# Altium schematic sheet P02_Power Management.SchDoc
size 386 x 246 mm
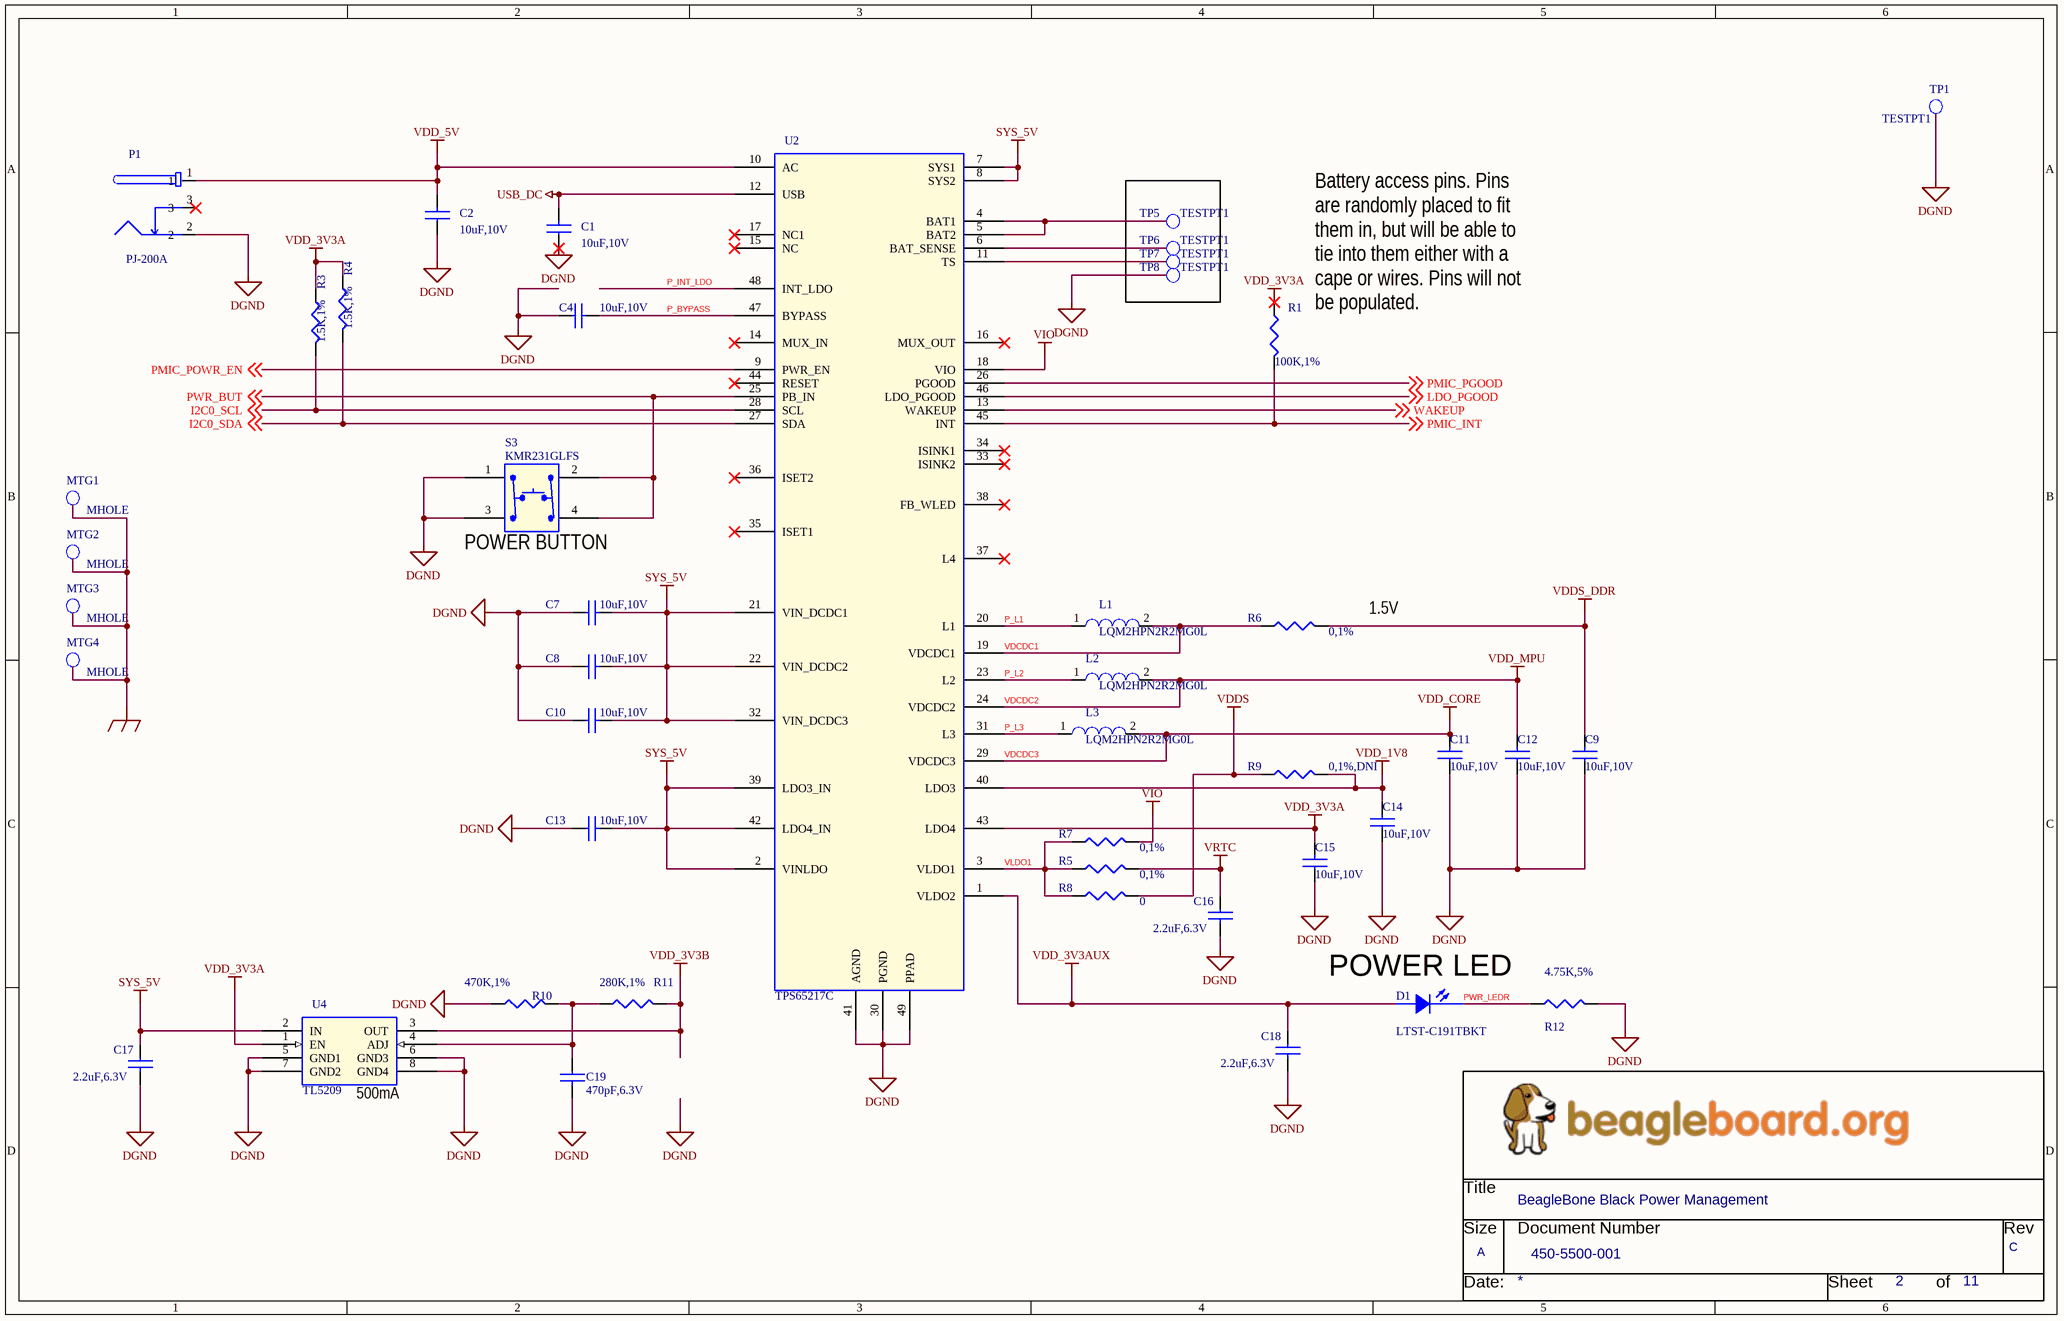
[diagram p0: P02_Power Management.SchDoc]

## Parts
*  Page Count: 11  Page Number: 2  Page Size: A  Title: BeagleBone Black Power Management  RevCode: C  Doc: 450-5500-001  (hidden comment: BeagleBoard_org)  (graphical)
C1  10uF,10V  [r402-25rd]
C2  10uF,10V  [r402-25rd]
C4  10uF,10V  [r402-25rd]
C7  10uF,10V  [r402-25rd]
C8  10uF,10V  [r402-25rd]
C9  10uF,10V  [r402-25rd]
C10  10uF,10V  [r402-25rd]
C11  10uF,10V  [r402-25rd]
C12  10uF,10V  [r402-25rd]
C13  10uF,10V  [r402-25rd]
C14  10uF,10V  [r402-25rd]
C15  10uF,10V  [r402-25rd]
C16  2.2uF,6.3V  [402]
C17  2.2uF,6.3V  [402]
C18  2.2uF,6.3V  [402]
C19  470pF,6.3V  [402]
D1  LTST-C191TBKT  [led1206-59x59]
L1  LQM2HPN2R2MG0L  [VLCF5020T]
L2  LQM2HPN2R2MG0L  [VLCF5020T]
L3  LQM2HPN2R2MG0L  [VLCF5020T]
MTG1  MHOLE  [mh230-156]
MTG2  MHOLE  [mh230-156]
MTG3  MHOLE  [mh230-156]
MTG4  MHOLE  [mh230-156]
P1  PJ-200A  [CONN3-PWR-PJ102A]
R1  100K,1%  [402]
R3  1.5K,1%  [402]
R4  1.5K,1%  [402]
R5  0,1%  [402]
R6  0,1%  [402]
R7  0,1%  [402]
R8  0  [402]
R9  0,1%,DNI  [402]
R10  470K,1%  [402]
R11  280K,1%  [402]
R12  4.75K,5%  [402]
S3  KMR231GLFS  [SM-SW-SPST-4-4]
TP1  TESTPT1  [tp1-8040]
TP5  TESTPT1  [tp1-8040]
TP6  TESTPT1  [tp1-8040]
TP7  TESTPT1  [tp1-8040]
TP8  TESTPT1  [tp1-8040]
U2  TPS65217C  [TBD]
U4  TL5209  [SO8-25X75]

## Nets
DGND: C1.1 C2.1 C4.1 C7.1 C8.1 C9.1 C10.1 C11.1 C12.1 C13.1 C14.1 C15.1 C16.2 C17.2 C18.2 C19.2 P1.2 R10.2 R12.1 S3.1(A1) S3.3(A2) TP1.1(TP) TP8.1(TP) U2.30(PGND) U2.41(AGND) U2.49(PPAD) U4.5(GND1) U4.6(GND3) U4.7(GND2) U4.8(GND4)
GND_EARTH: MTG1.1(TP) MTG2.1(TP) MTG3.1(TP) MTG4.1(TP)
SYS_5V: C7.2 C8.2 C10.2 C13.2 C17.1 U2.2(VINLDO) U2.7(SYS1) U2.8(SYS2) U2.21(VIN_DCDC1) U2.22(VIN_DCDC2) U2.32(VIN_DCDC3) U2.39(LDO3_IN) U2.42(LDO4_IN) U4.2(IN)
USB_DC: C1.2 U2.12(USB)
VDCDC2: C12.2 L2.2 U2.24(VDCDC2)  [also labelled VDD_MPU]
VDCDC3: C11.2 L3.2 U2.29(VDCDC3)  [also labelled VDD_CORE]
VDD_1V8: C14.2 R9.2 U2.40(LDO3)
VDD_3V3A: C15.2 R1.1 R3.1 R4.1 U2.43(LDO4) U4.1(EN)
VDD_3V3AUX: C18.1 D1.2(A) U2.1(VLDO2)
VDD_3V3B: R11.1 U4.3(OUT)
VDD_5V: C2.2 P1.1 U2.10(AC)
VDDS: R8.2 R9.1
VDDS_DDR: C9.2 R6.2
VIO: R7.2 U2.18(VIO)
VRTC: C16.1 R5.2
I2C0_SCL: R3.2 U2.28(SCL) ; off-sheet I2C0_SCL
I2C0_SDA: R4.2 U2.27(SDA) ; off-sheet I2C0_SDA
LDO_PGOOD: U2.46(LDO_PGOOD) ; off-sheet LDO_PGOOD
P_BYPASS: C4.2 U2.47(BYPASS)
P_INT_LDO: U2.48(INT_LDO)
P_L1: L1.1 U2.20(L1)
P_L2: L2.1 U2.23(L2)
P_L3: L3.1 U2.31(L3)
PMIC_INT: R1.2 U2.45(INT) ; off-sheet PMIC_INT
PMIC_PGOOD: U2.26(PGOOD) ; off-sheet PMIC_PGOOD
PMIC_POWR_EN: U2.9(PWR_EN) ; off-sheet PMIC_POWR_EN
PWR_BUT: S3.2(B1) S3.4(B2) U2.25(PB_IN) ; off-sheet PWR_BUT
PWR_LEDR: D1.1(C) R12.2
VDCDC1: L1.2 R6.1 U2.19(VDCDC1)
VLDO1: R5.1 R7.1 R8.1 U2.3(VLDO1)
WAKEUP: U2.13(WAKEUP) ; off-sheet WAKEUP
NetC19_1: C19.1 R10.1 R11.2 U4.4(ADJ)
NetTP5_1: TP5.1(TP) U2.4(BAT1) U2.5(BAT2)
NetTP6_1: TP6.1(TP) U2.6(BAT_SENSE)
NetTP7_1: TP7.1(TP) U2.11(TS)

Not connected (* = marked no-connect by the designer): P1 3*; U2 14(MUX_IN)* 15(NC)* 16(MUX_OUT)* 17(NC1)* 33(ISINK2)* 34(ISINK1)* 35(ISET1)* 36(ISET2)* 37(L4)* 38(FB_WLED)* 44(RESET)*

## Notes on the sheet
- (near R1) Battery access pins. Pins
  are randomly placed to fit
  them in, but will be able to
  tie into them either with a
  cape or wires. Pins will not
  be populated.
- (near S3) POWER BUTTON
- 1.5V
- (near D1) POWER LED
- (near U4) 500mA
- (in symbol BeagleBoard_org) Title; Size; Document Number; Rev; Date:; Sheet; of

## Library data of the parts
C1 C2 C4 C7-C15 = CAP_10uF_Y5V_10V_10%_0805: Desc: CAP CER 10UF 10V Y5V 0805; PCB Footprint: 805; Part Number: CAP_10uF_Y5V_10V_10%_0805
C16-C18 = CAP_2.2uF_X5R_6.3V_10%_0402: Desc: CAP, CER, X7R, 0402, 50V, 10%, 0.1uF; Part Number: CAP_2.2uF_X5R_6.3V_10%_0402; PCB Footprint: 402
C19 = CAP_470PF_X7R_25V_10%_0402: Desc: Capacitor 470pF 25V 10% X7R; Part Number: CAP_470PF_X7R_25V_10%_0402; PCB Footprint: 402
D1 = LED_LTST-C150GKT_0: TN: 257-0020-000; CLASS: DISCRETE; PCB Footprint: LED_0603
L1-L3 = IND_2.2uH_2.6A_10%_SMD: Inductor 2.2uH smt 2.6A, 58 milliohm; TIIntPartnumber: 1L0025; MfrNum: VLCF5020T-2R2N2R6-3; Mfr: TDK; PartName: 2.2uH10%2.6Asmd; PCB Footprint: smd0.157inx0.157in; Cost10K: 0.37; Cost100: 1.11; Vendor: Digikey
MTG1-MTG4 = MHOLE: PCB Footprint: MTGH200C125D_PL
P1 = Power_Jack: PCB Footprint: CONN3-PWR-PJ102A
R1 = RES_100K_1/16W_1%_0402: Resistor 100Kohm 1/16W 1% 0402; Part Number: RES_100K_1/16W_1%_0402; PCB Footprint: 402
R3 R4 = RES_1.5K_1/16W_5%_0402_Dup1: RES 1.5K OHM 1/16W 5% 0402 SMD; Part Number: RES_1.5K_1/16W_5%_0402; PCB Footprint: 402
R5-R9 = RES_4.75K_1/16W_1%_0402: RES 4.75K OHM 1/16W 1% 0402 SMD; Part Number: RES_4.75K_1/16W_1%_0402; PCB Footprint: 402
R10-R12 = RES_470_1/10W_5%_0402: RES 470 OHM 1/10W 5% 0402 SMD; Part Number: RES_470_1/10W_5%_0402; PCB Footprint: 402
S3 = SW_KT11P2JM_2: CLASS: DISCRETE; TN: 276-0043-000; PCB Footprint: SW4SMD_63X161LS
TP5-TP8 = TESTPT1: PCB Footprint: TP60C33D
U2 = PWR_TPS65217_2: PCB Footprint: U_48_RSL
U4 = PWR_TLV70233DBV_0: PCB Footprint: SO8-25X75
* = BeagleBoard_org: Page Create Date: March  8, 1995; Page Modify Date: *
TP1 = TESTPT1: PCB Footprint: tp1-8040